# EAGLE schematic pre-charger-v1.0 (EAGLE 7.7.0)
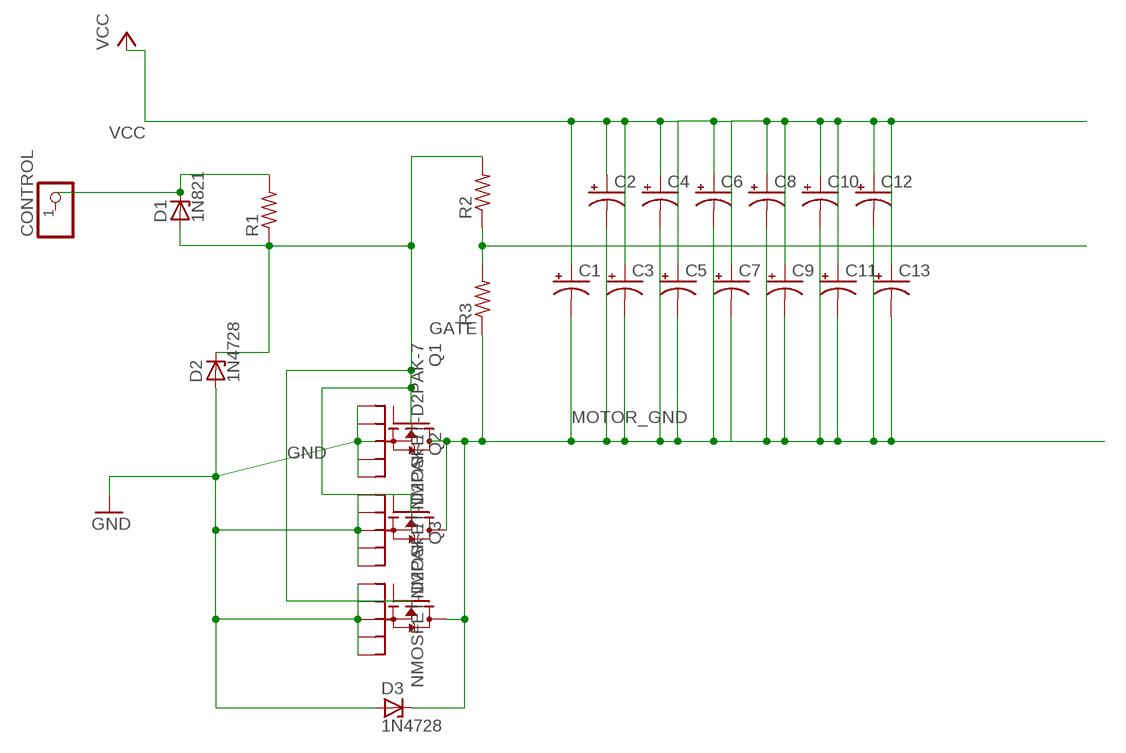
[diagram p0: schematic, sheet 1]

## Parts
C1  CPOL-USE5-13  [E5-13]
C2  CPOL-USE5-13  [E5-13]
C3  CPOL-USE5-13  [E5-13]
C4  CPOL-USE5-13  [E5-13]
C5  CPOL-USE5-13  [E5-13]
C6  CPOL-USE5-13  [E5-13]
C7  CPOL-USE5-13  [E5-13]
C8  CPOL-USE5-13  [E5-13]
C9  CPOL-USE5-13  [E5-13]
C10  CPOL-USE5-13  [E5-13]
C11  CPOL-USE5-13  [E5-13]
C12  CPOL-USE5-13  [E5-13]
C13  CPOL-USE5-13  [E5-13]
CONTROL  PINHD-1X1  [1X01]
D1  1N821  [DO35Z10]
D2  1N4728  [DO41Z10]
D3  1N4728  [DO41Z10]
Q1  NMOSFET-D2PAK-7  [D2PAK-7]
Q2  NMOSFET-D2PAK-7  [D2PAK-7]
Q3  NMOSFET-D2PAK-7  [D2PAK-7]
R1  R-US_0204/7  [0204/7]
R2  R-US_0204/7  [0204/7]
R3  R-US_0204/7  [0204/7]

## Nets
3.3V_OUT: R2.1 R3.2
GATE: D1.A D2.C R1.1 R2.2
GND: D2.A D3.A Q1.S1 Q1.S2 Q1.S3 Q1.S4 Q1.S5 Q2.S1 Q2.S5 Q3.S1 Q3.S5
MOTOR_GND: C1.- C2.- C3.- C4.- C5.- C6.- C7.- C8.- C9.- C10.- C11.- C12.- C13.- D3.C Q1.D Q2.D Q3.D R3.1
N$2: D1.C R1.2
VCC: C1.+ C2.+ C3.+ C4.+ C5.+ C6.+ C7.+ C8.+ C9.+ C10.+ C11.+ C12.+ C13.+
Unconnected: CONTROL.1 Q1.G Q2.G Q2.S2 Q2.S3 Q2.S4 Q3.G Q3.S2 Q3.S3 Q3.S4

## Library data of the parts
C1-C13 = rcl:CPOL-US: POLARIZED CAPACITOR, American symbol
CONTROL = pinhead:PINHD-1X1: PIN HEADER
D1 = diode:1N821: Reference DIODE temperature compensated, 6,2 V
D2 D3 = diode:1N4728: Z DIODE 3.3 V, 1W, 5 percent
Q1-Q3 = D2PAK-7:NMOSFET-D2PAK-7
R1-R3 = rcl:R-US_: RESISTOR, American symbol